# EAGLE design AD9833_FG_Main_3V3 (EAGLE 7.2.0)
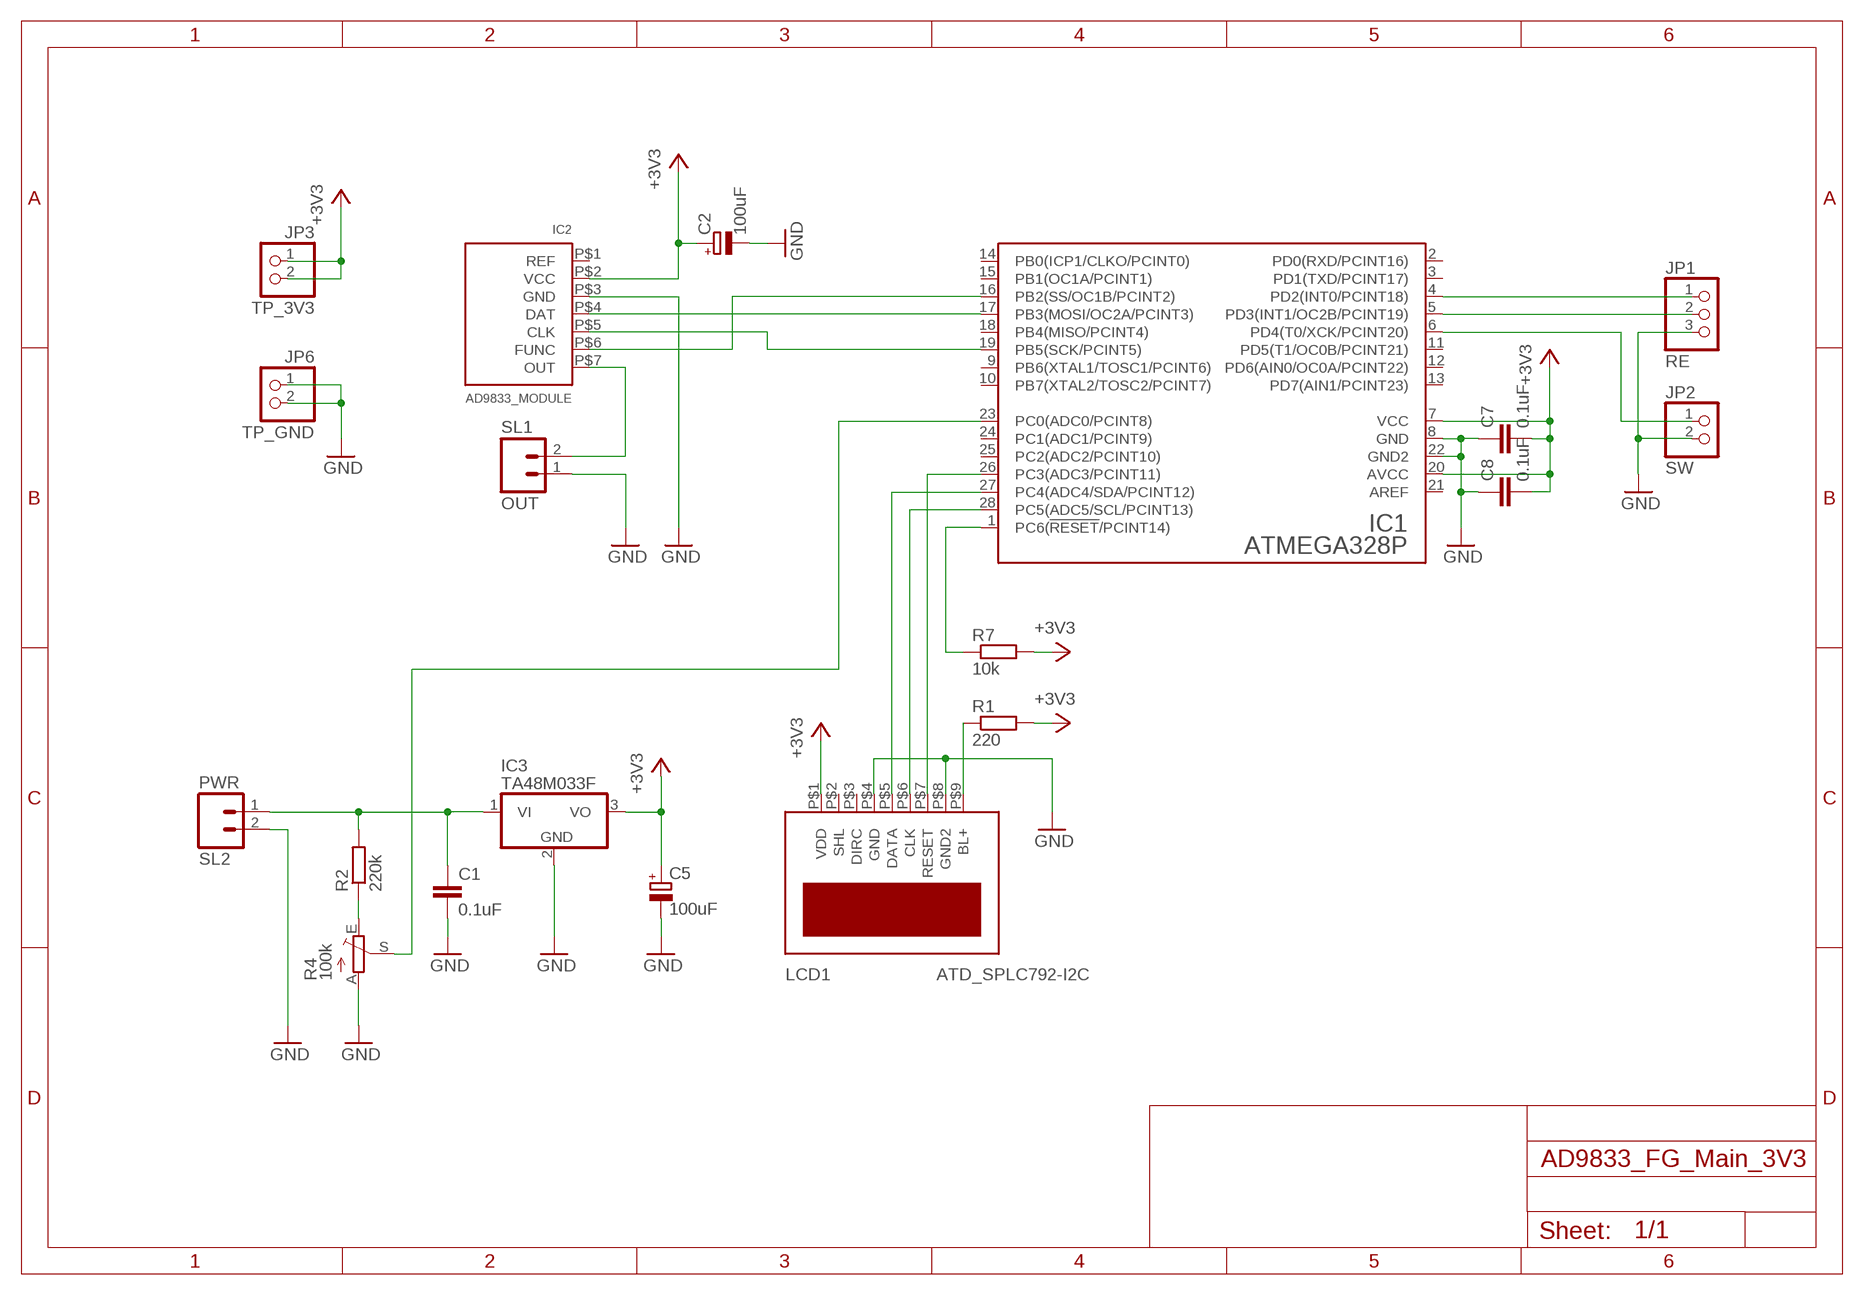
[diagram p0: schematic, sheet 1]

## Parts
C1  0.1uF  C-EU025-024X044  [C025-024X044]
C2  100uF  CPOL-EUSANYO_C  [SANYO-OSCON_C]
C5  100uF  CPOL-EUE2.5-7  [E2,5-7]
C7  0.1uF  C-EU025-024X044  [C025-024X044]
C8  0.1uF  C-EU050-024X044  [C050-024X044]
IC1  ATMEGA328P  ATMEGA48/88/168  [DIL28-3]
IC2  AD9833_MODULE  [AD9833_MODULE]
IC3  TA48M033F  [TA48MXXX]
JP1  RE  PINHD-1X3  [1X03]
JP2  SW  PINHD-1X2  [1X02]
JP3  TP_3V3  PINHD-1X2  [1X02]
JP6  TP_GND  PINHD-1X2  [1X02]
LCD1  ATD_SPLC792-I2C  [ATD_SPLC792-I2C]
R1  220  R-EU_0207/7  [0207/7]
R2  220k  R-EU_0207/7  [0207/7]
R4  100k  TRIM_EU-B25P  [B25P]
R7  10k  R-EU_0207/7  [0207/7]
SL1  OUT  M02  [02P]
SL2  PWR  M02  [02P]

## Nets
+3V3: C2.+ C5.+ C7.2 C8.2 IC1.7(VCC) IC1.20(AVCC) IC2.P$2(VCC) IC3.3(VO) JP3.1 JP3.2 LCD1.P$1(VDD) R1.2 R7.2
GND: C1.2 C2.- C5.- C7.1 C8.1 IC1.8(GND) IC1.22(GND2) IC2.P$3(GND) IC3.2(GND) JP1.3 JP2.2 JP6.1 JP6.2 LCD1.P$4(GND) LCD1.P$8(GND2) R4.A SL1.1 SL2.2
N$1: IC1.17(PB3(MOSI/OC2A/PCINT3)) IC2.P$4(DAT)
N$2: IC1.19(PB5(SCK/PCINT5)) IC2.P$5(CLK)
N$3: IC1.16(PB2(SS/OC1B/PCINT2)) IC2.P$6(FUNC)
N$4: IC1.28(PC5(ADC5/SCL/PCINT13)) LCD1.P$6(CLK)
N$5: IC1.27(PC4(ADC4/SDA/PCINT12)) LCD1.P$5(DATA)
N$6: IC2.P$7(OUT) SL1.2
N$7: IC1.26(PC3(ADC3/PCINT11)) LCD1.P$7(RESET)
N$8: IC1.4(PD2(INT0/PCINT18)) JP1.1
N$9: IC1.5(PD3(INT1/OC2B/PCINT19)) JP1.2
N$10: IC1.6(PD4(T0/XCK/PCINT20)) JP2.1
N$11: R2.1 R4.E
N$14: LCD1.P$9(BL+) R1.1
N$15: C1.1 IC3.1(VI) R2.2 SL2.1
N$16: IC1.23(PC0(ADC0/PCINT8)) R4.S
N$18: IC1.1(PC6(!RESET!/PCINT14)) R7.1
Unconnected: IC1.2(PD0(RXD/PCINT16)) IC1.3(PD1(TXD/PCINT17)) IC1.9(PB6(XTAL1/TOSC1/PCINT6)) IC1.10(PB7(XTAL2/TOSC2/PCINT7)) IC1.11(PD5(T1/OC0B/PCINT21)) IC1.12(PD6(AIN0/OC0A/PCINT22)) IC1.13(PD7(AIN1/PCINT23)) IC1.14(PB0(ICP1/CLKO/PCINT0)) IC1.15(PB1(OC1A/PCINT1)) IC1.18(PB4(MISO/PCINT4)) IC1.21(AREF) IC1.24(PC1(ADC1/PCINT9)) IC1.25(PC2(ADC2/PCINT10)) IC2.P$1(REF) LCD1.P$2(SHL) LCD1.P$3(DIRC)

## Library data of the parts
C1 C7 C8 = rcl:C-EU: CAPACITOR, European symbol
C2 C5 = rcl:CPOL-EU: POLARIZED CAPACITOR, European symbol
IC1 = mylib2:ATMEGA48/88/168
IC2 = mylib2:AD9833_MODULE: AD9833 DDS Module
IC3 = mylib2:TA48M033F: 3.3V LDO
JP1 = pinhead:PINHD-1X3: PIN HEADER
JP2 JP3 JP6 = pinhead:PINHD-1X2: PIN HEADER
LCD1 = mylib2:ATD_SPLC792-I2C: aitendo I2C LCD SPLC792-I2C
R1 R2 R7 = rcl:R-EU_: RESISTOR, European symbol
R4 = pot:TRIM_EU-: POTENTIOMETER
SL1 SL2 = con-amp-quick:M02: AMP QUICK CONNECTOR; OC_FARNELL: unknown; OC_NEWARK: unknown

## Board
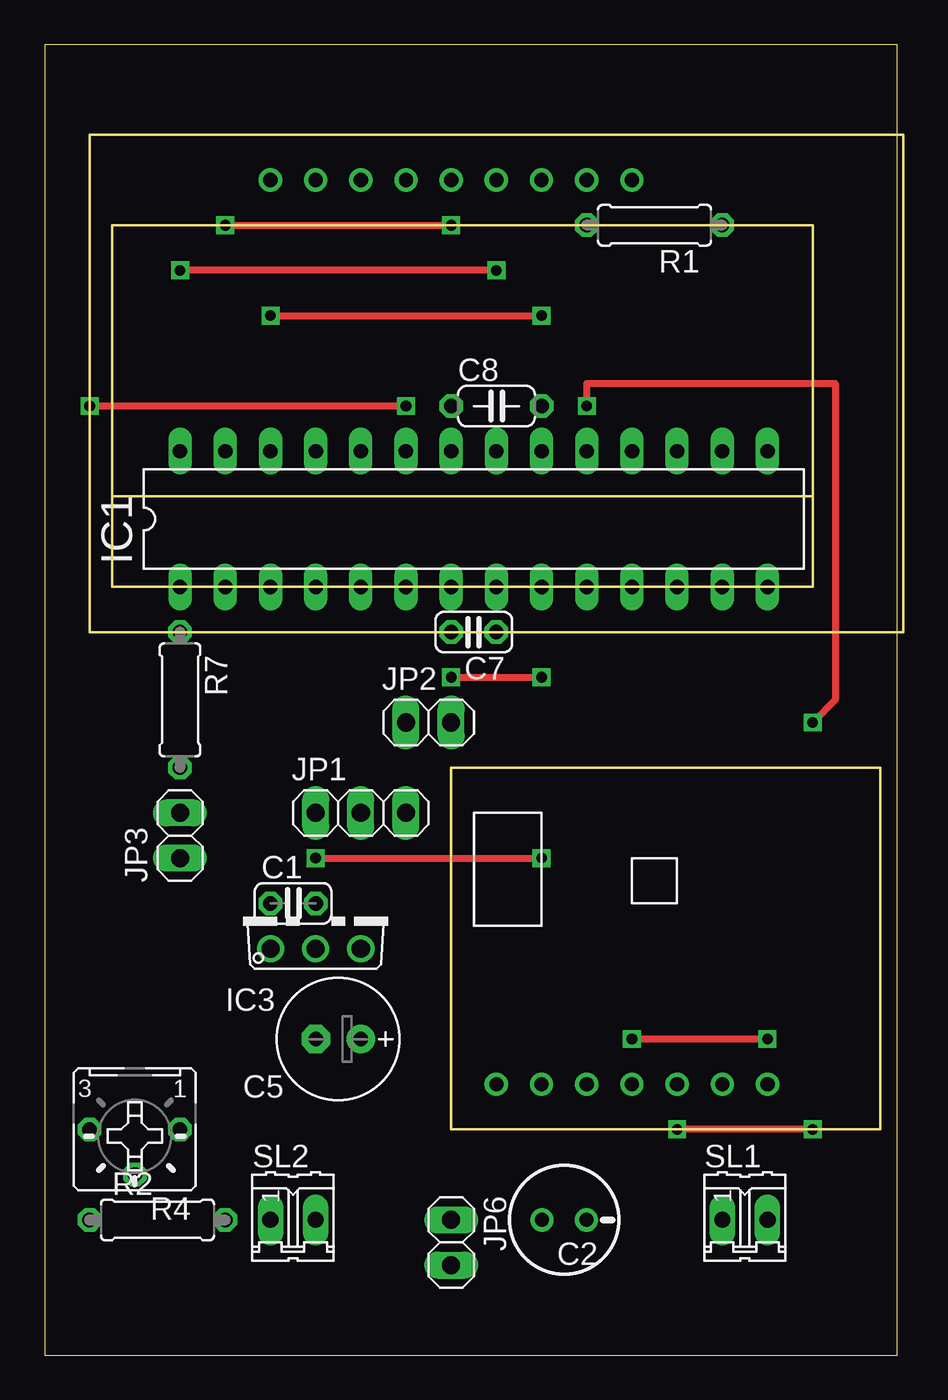
[diagram p1: board, top side]
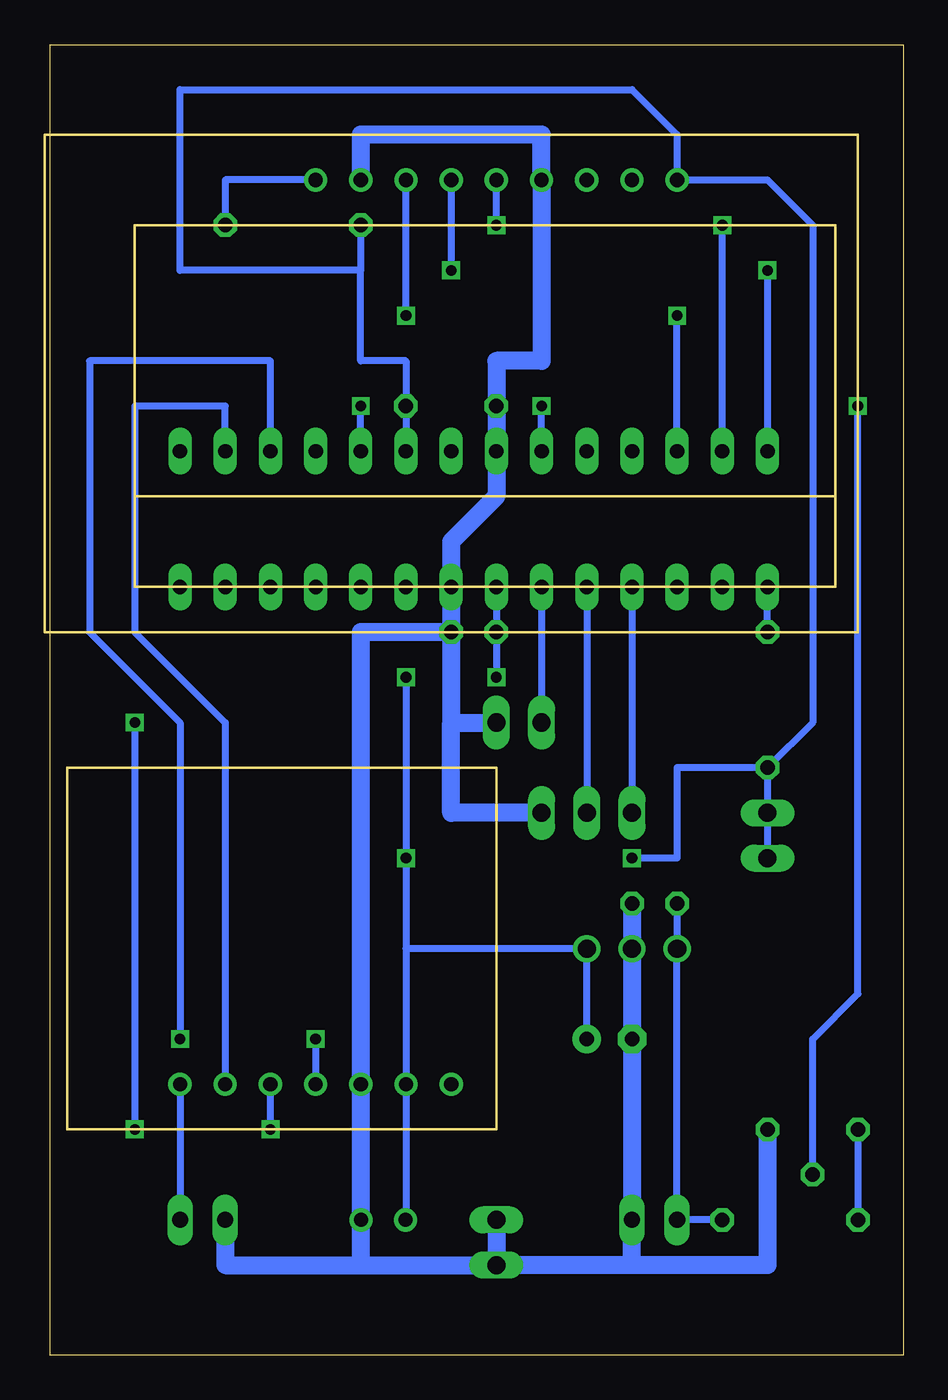
[diagram p2: board, bottom side, seen from below]

Size 47.93 x 73.65 mm. Coordinates in mm from the lower left corner, seen from the top.
Outline: 0,0 47.93,0 47.93,73.65 0,73.65 0,0
Copper layers (1*16): Top 0.035mm / dielectric 1.5mm / Bottom 0.035mm
Design rules "default": minimum track width 10mil, minimum drill 24mil, track to track 8mil, track to pad 8mil, pad to pad 8mil, via to via 8mil, smd to smd 8mil, copper to edge 40mil, drill to drill 8mil, minimum pad ring 10mil, minimum via ring 8mil, stop-mask expansion 4mil, vias tented up to drill 0mil, thermal gap 10mil

### Footprints (pad centres in the part's own frame; a part is rotated, then mirrored left to right if it is on the bottom)
C025-024X044 = drill 0.813 octagon: 1 -1.27,0; 2 1.27,0
SANYO-OSCON_C = drill 0.8 pad 1.27: + 1.25,0; - -1.25,0
E2,5-7 = drill 0.813 pad 1.6: + -1.27,0 | drill 0.813 pad 1.6 octagon: - 1.27,0
C050-024X044 = drill 0.813 octagon: 1 -2.54,0; 2 2.54,0
DIL28-3 = drill 0.813 long: 1 -15.24,-3.81; 2 -12.7,-3.81; 3 -10.16,-3.81; 4 -7.62,-3.81; 5 -5.08,-3.81; 6 -2.54,-3.81; 7 0,-3.81; 8 2.54,-3.81; 9 5.08,-3.81; 10 7.62,-3.81; 11 10.16,-3.81; 12 12.7,-3.81; 13 15.24,-3.81; 14 17.78,-3.81; 15 17.78,3.81; 16 15.24,3.81; 17 12.7,3.81; 18 10.16,3.81; 19 7.62,3.81; 20 5.08,3.81; 21 2.54,3.81; 22 0,3.81; 23 -2.54,3.81; 24 -5.08,3.81; 25 -7.62,3.81; 26 -10.16,3.81; 27 -12.7,3.81; 28 -15.24,3.81
AD9833_MODULE = drill 0.8: P$1 -10.16,-2.54; P$2 -7.62,-2.54; P$3 -5.08,-2.54; P$4 -2.54,-2.54; P$5 0,-2.54; P$6 2.54,-2.54; P$7 5.08,-2.54
TA48MXXX = drill 1.016: 1 -2.54,0; 2 0,0; 3 2.54,0
1X03 = drill 1.016 long: 1 -2.54,0; 2 0,0; 3 2.54,0
1X02 = drill 1.016 long: 1 -1.27,0; 2 1.27,0
ATD_SPLC792-I2C = drill 0.8: P$1 -8.89,5.08; P$2 -6.35,5.08; P$3 -3.81,5.08; P$4 -1.27,5.08; P$5 1.27,5.08; P$6 3.81,5.08; P$7 6.35,5.08; P$8 8.89,5.08; P$9 11.43,5.08
0207/7 = drill 0.813 octagon: 1 -3.81,0; 2 3.81,0
B25P = drill 0.813 octagon: A -2.54,0; E 2.54,0; S 0,2.54
02P = drill 0.914 long: 1 -1.27,0; 2 1.27,0

### Placement (x,y rotation side)
C1  13.97,25.4 0 top
C2  29.21,7.62 180 top
C5  16.51,17.78 180 top
C7  24.13,40.64 180 top
C8  25.4,53.34 0 top
IC1  22.86,46.99 0 top
IC2  35.56,17.78 0 top
IC3  15.24,22.86 0 top
JP1  17.78,30.48 0 top
JP2  21.59,35.56 0 top
JP3  7.62,29.21 90 top
JP6  22.86,6.35 270 top
LCD1  21.59,60.96 0 top
R1  34.29,63.5 180 top
R2  6.35,7.62 0 top
R4  5.08,12.7 180 top
R7  7.62,36.83 270 top
SL1  39.37,7.62 0 top
SL2  13.97,7.62 0 top

### Tracks (layer width: path | path; a pad name or v marks a point on that pad's centre or on a via)
+3V3  (via drill 0.6)
  Top 0.406: v22.86,38.1 v27.94,38.1 | v15.24,27.94 v27.94,27.94
  Bottom 0.406: R1.2 30.48,60.96 | 30.48,60.96 40.64,60.96 40.64,71.12 15.24,71.12 12.7,68.58 LCD1.P$1 7.62,66.04 5.08,63.5 5.08,35.56 R7.2 | 30.48,60.96 30.48,55.88 27.94,55.88 C8.2 IC1.20 | v22.86,38.1 C7.2 IC1.7 | v27.94,38.1 v27.94,27.94 27.94,22.86 | 27.94,22.86 IC2.P$2 27.94,7.64 C2.+ | v15.24,27.94 12.7,27.94 12.7,33.02 R7.2 | 27.94,22.86 IC3.3 C5.+ | R7.2 JP3.2 JP3.1
GND
  Bottom 1.016: LCD1.P$8 30.48,68.58 20.32,68.58 LCD1.P$4 20.32,55.88 22.86,55.88 C8.1 IC1.22 22.86,48.26 25.4,45.72 IC1.8 C7.1 | C7.1 25.4,35.56 | 25.4,35.56 JP2.2 | JP1.3 25.4,30.48 25.4,35.56 | C5.- IC3.2 C1.2 SL2.2 15.24,5.08 | 30.48,7.62 C2.- 30.48,7.64 | JP6.1 JP6.2 | R4.A 7.62,5.08 15.24,5.08 | 30.48,7.64 IC2.P$3 30.48,40.64 C7.1 | 15.24,5.08 JP6.2 | 30.48,7.64 30.48,5.08 | 30.48,5.08 JP6.2 | SL1.1 38.1,5.08 30.48,5.08
N$1  (via drill 0.6)
  Top 0.406: v40.64,17.78 v33.02,17.78
  Bottom 0.406: IC1.17 35.56,55.88 45.72,55.88 45.72,40.64 40.64,35.56 v40.64,17.78 | v33.02,17.78 IC2.P$4
N$2  (via drill 0.6)
  Top 0.406: v43.18,35.56 44.45,36.83 44.45,54.61 30.48,54.61 v30.48,53.34 | v43.18,12.7 v35.56,12.7
  Bottom 0.406: IC1.19 v30.48,53.34 | v43.18,35.56 v43.18,12.7 | v35.56,12.7 IC2.P$5
N$3
  Bottom 0.406: IC1.16 38.1,53.34 43.18,53.34 43.18,40.64 38.1,35.56 IC2.P$6
N$4  (via drill 0.6)
  Top 0.406: v25.4,60.96 v7.62,60.96
  Bottom 0.406: LCD1.P$6 v25.4,60.96 | v7.62,60.96 IC1.28
N$5  (via drill 0.6)
  Top 0.406: v10.16,63.5 v22.86,63.5
  Bottom 0.406: IC1.27 v10.16,63.5 | v22.86,63.5 LCD1.P$5
N$6
  Bottom 0.406: IC2.P$7 SL1.2
N$7  (via drill 0.6)
  Top 0.406: v12.7,58.42 v27.94,58.42
  Bottom 0.406: IC1.26 v12.7,58.42 | v27.94,58.42 LCD1.P$7
N$8
  Bottom 0.406: IC1.4 JP1.1
N$9
  Bottom 0.406: IC1.5 JP1.2
N$10
  Bottom 0.406: IC1.6 JP2.1
N$11
  Bottom 0.406: R4.E R2.1
N$14
  Bottom 0.406: LCD1.P$9 38.1,66.04 R1.1
N$15
  Bottom 0.406: R2.2 SL2.1 IC3.1 C1.1
N$16  (via drill 0.6)
  Top 0.406: v20.32,53.34 v2.54,53.34
  Bottom 0.406: IC1.23 v20.32,53.34 | R4.S 5.08,17.78 2.54,20.32 v2.54,53.34
N$18
  Bottom 0.406: R7.1 IC1.1